# Altium project TDA1554Q 2.1 Audio Amplifier.PrjPcb
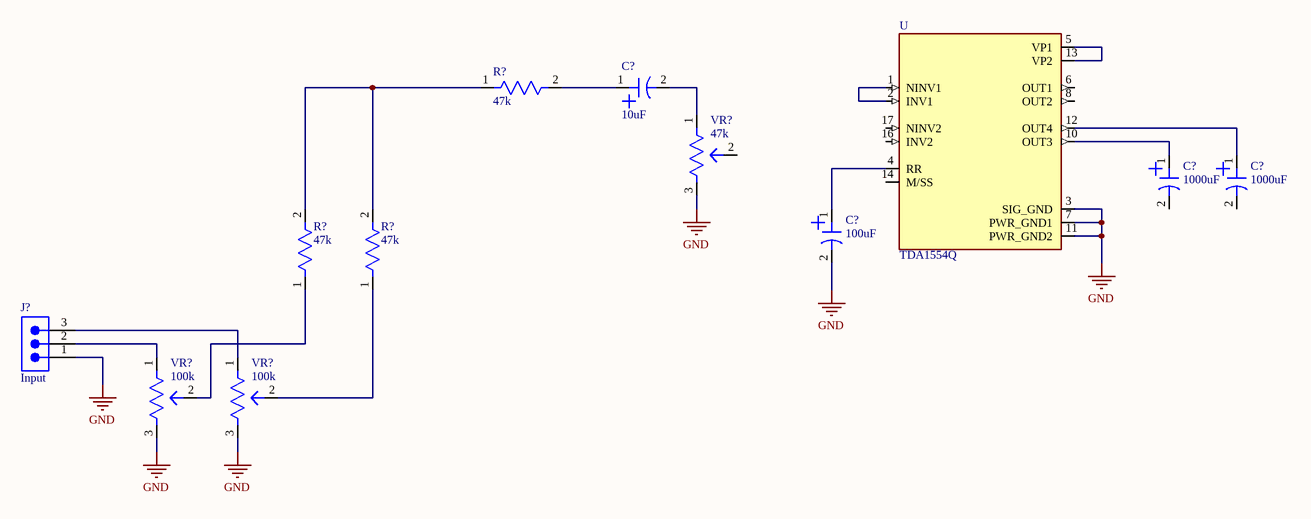
[diagram p0: tda1554q amplifier.SchDoc]
1 sheet, 12 parts. Net scope: global (net labels, ports and power ports of the same name join across sheets).

## Sheet tda1554q amplifier.SchDoc
size A4; SheetNumber: 1; SheetTotal: 1

### Parts
(Parts that share a designator on the sheet are numbered #1, #2 ... from top to bottom, then left to right.)
C?#1  10uF  [Capacitor 5x11mm]
C?#2  1000uF  [Capacitor 13x21mm]
C?#3  1000uF  [Capacitor 13x21mm]
C?#4  100uF  [Capacitor 5x11mm]
J?  Input  [61900311121]
R?#1  47k  [Resistor 0207 1/4W]
R?#2  47k  [Resistor 0207 1/4W]
R?#3  47k  [Resistor 0207 1/4W]
U  TDA1554Q  [TO127P2400X460X1700-17]
VR?#1  47k  [Conector Goldpin 1x3]
VR?#2  100k  [Conector Goldpin 1x3]
VR?#3  100k  [Conector Goldpin 1x3]

### Nets
GND: C?#4.2 J?.1 U.3(SIG_GND) U.7(PWR_GND1) U.11(PWR_GND2) VR?#1.3 VR?#2.3 VR?#3.3
NetC?#1_1: C?#1.1 R?#1.2
NetC?#1_2: C?#1.2 VR?#1.1
NetC?#2_1: C?#2.1 U.10(OUT3)
NetC?#3_1: C?#3.1 U.12(OUT4)
NetC?#4_1: C?#4.1 U.4(RR)
NetJ?_2: J?.2 VR?#2.1
NetJ?_3: J?.3 VR?#3.1
NetR?#1_1: R?#1.1 R?#2.2 R?#3.2
NetR?#2_1: R?#2.1 VR?#2.2
NetR?#3_1: R?#3.1 VR?#3.2
NetU_1: U.1(NINV1) U.2(INV1)
NetU_5: U.5(VP1) U.13(VP2)

Not connected (* = marked no-connect by the designer): C?#2 2; C?#3 2; U 6(OUT1) 8(OUT2) 14(M/SS) 16(INV2) 17(NINV2); VR?#1 2

### Library data of the parts
C?#1-C?#4 = Capacitor Polar
J? = CMP-1502-00585-2: NexarPartId: 18818222; Current Rating: 3A; Voltage Rating: 250V; Number of Positions: 3; Insulation Resistance: 1GΩ; Gender: Male; Pitch: 2.54mm; Connector Type: Male Pin; Contact Resistance: 20mΩ; Termination: Through Hole; Width: 7.66mm; Contact Plating: Tin; Orientation: Vertical; Mount: Through Hole; Contact Gender: Male; Max Operating Temperature: 105°C; Length: 7.62mm; Number of Rows: 1; Height: 12.5mm; Lead Pitch: 2.54mm; Housing Material: Nylon; Color: Beige; Contact Material: Copper; Fastening Type: Friction; Min Operating Temperature: -40°C; Number of Contacts: 3; Number of Pins: 3; Flammability Rating: UL94 V-0; Contact Mating Length: 7.493mm; RoHS: Compliant; REACH SVHC: Unknown; Packaging: Bulk; Operating Supply Voltage: 250V
R?#1-R?#3 = Resistor
U = TDA1554Q: Amplifier IC 2-Channel _Stereo_ or 4-Channel _Quad_ Class B DBS17P; MF: NXP USA; Value: *; Availability: Unavailable; Package: SIP-17 NXP USA; Price: None; SnapEDA_Link: https://www.snapeda.com/parts/TDA1554Q/NXP%20USA%20Inc./view-part/762394/?ref=snap; MP: TDA1554Q
VR?#1-VR?#3 = Potentiometer Goldpin